# Altium schematic sheet SDRAM.SchDoc
size A; SheetNumber: 2; SheetTotal: 5
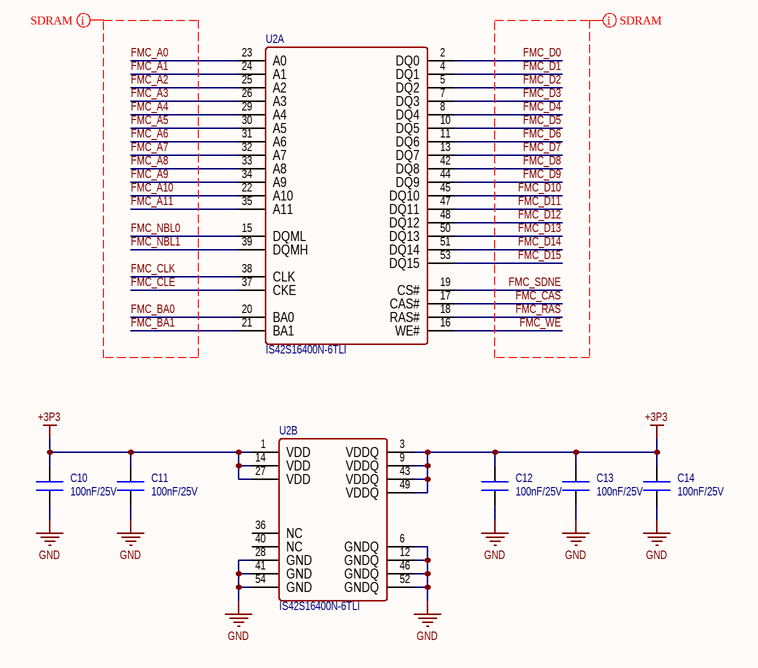
[diagram p0: SDRAM.SchDoc]

## Parts
C10  100nF/25V  [CN-SMD-0603]
C11  100nF/25V  [CN-SMD-0603]
C12  100nF/25V  [CN-SMD-0603]
C13  100nF/25V  [CN-SMD-0603]
C14  100nF/25V  [CN-SMD-0603]
U2  IS42S16400N-6TLI  [TSOP80P1180X100-54N]  (parts A,B of 2)

## Nets
+3P3: C10.2 C11.2 C12.2 C13.2 C14.2 U2.1(VDD) U2.3(VDDQ) U2.9(VDDQ) U2.14(VDD) U2.27(VDD) U2.43(VDDQ) U2.49(VDDQ)
GND: C10.1 C11.1 C12.1 C13.1 C14.1 U2.6(GNDQ) U2.12(GNDQ) U2.28(GND) U2.41(GND) U2.46(GNDQ) U2.52(GNDQ) U2.54(GND)
FMC_A0: U2.23(A0)
FMC_A1: U2.24(A1)
FMC_A2: U2.25(A2)
FMC_A3: U2.26(A3)
FMC_A4: U2.29(A4)
FMC_A5: U2.30(A5)
FMC_A6: U2.31(A6)
FMC_A7: U2.32(A7)
FMC_A8: U2.33(A8)
FMC_A9: U2.34(A9)
FMC_A10: U2.22(A10)
FMC_A11: U2.35(A11)
FMC_BA0: U2.20(BA0)
FMC_BA1: U2.21(BA1)
FMC_CAS: U2.17(CAS#)
FMC_CLE: U2.37(CKE)
FMC_CLK: U2.38(CLK)
FMC_D0: U2.2(DQ0)
FMC_D1: U2.4(DQ1)
FMC_D2: U2.5(DQ2)
FMC_D3: U2.7(DQ3)
FMC_D4: U2.8(DQ4)
FMC_D5: U2.10(DQ5)
FMC_D6: U2.11(DQ6)
FMC_D7: U2.13(DQ7)
FMC_D8: U2.42(DQ8)
FMC_D9: U2.44(DQ9)
FMC_D10: U2.45(DQ10)
FMC_D11: U2.47(DQ11)
FMC_D12: U2.48(DQ12)
FMC_D13: U2.50(DQ13)
FMC_D14: U2.51(DQ14)
FMC_D15: U2.53(DQ15)
FMC_NBL0: U2.15(DQML)
FMC_NBL1: U2.39(DQMH)
FMC_RAS: U2.18(RAS#)
FMC_SDNE: U2.19(CS#)
FMC_WE: U2.16(WE#)

Not connected (* = marked no-connect by the designer): U2 36(NC) 40(NC)

## Layout directives
net class SDRAM: FMC_A0, FMC_A1, FMC_A2, FMC_A3, FMC_A4, FMC_A5, FMC_A6, FMC_A7, FMC_A8, FMC_A9, FMC_A10, FMC_A11, FMC_BA0, FMC_BA1, FMC_CAS, FMC_CLE, FMC_CLK, FMC_D0, FMC_D1, FMC_D2, FMC_D3, FMC_D4, FMC_D5, FMC_D6, FMC_D7, FMC_D8, FMC_D9, FMC_D10, FMC_D11, FMC_D12, FMC_D13, FMC_D14, FMC_D15, FMC_NBL0, FMC_NBL1, FMC_RAS, FMC_SDNE, FMC_WE

## Library data of the parts
C10-C14 = CN: CAP CER 0.1UF 25V X7R 0603; PN: CL10B104KA8NNNC
U2 = IS42S16400N-6TLI: 1 Meg Bits x 16 Bits x 4 Banks (64-MBIT) SYNCHRONOUS DYNAMIC RAM; PN: IS42S16400N-6TLI